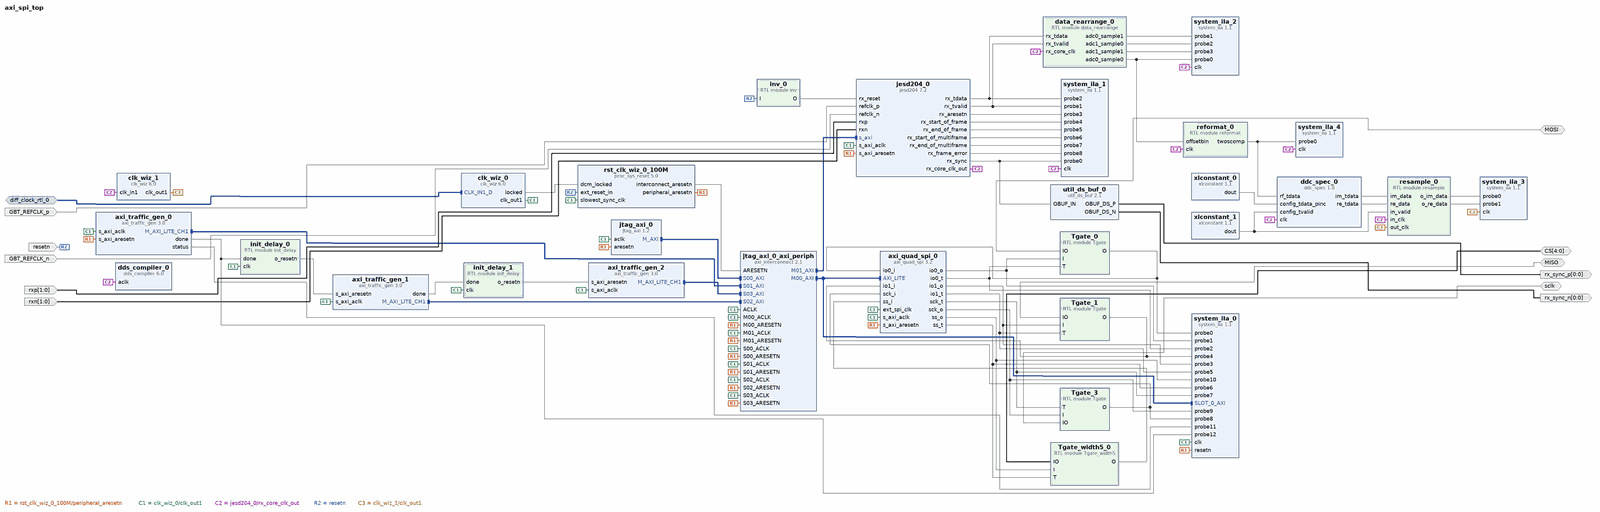
[diagram p0: block diagram of the top level, whole]
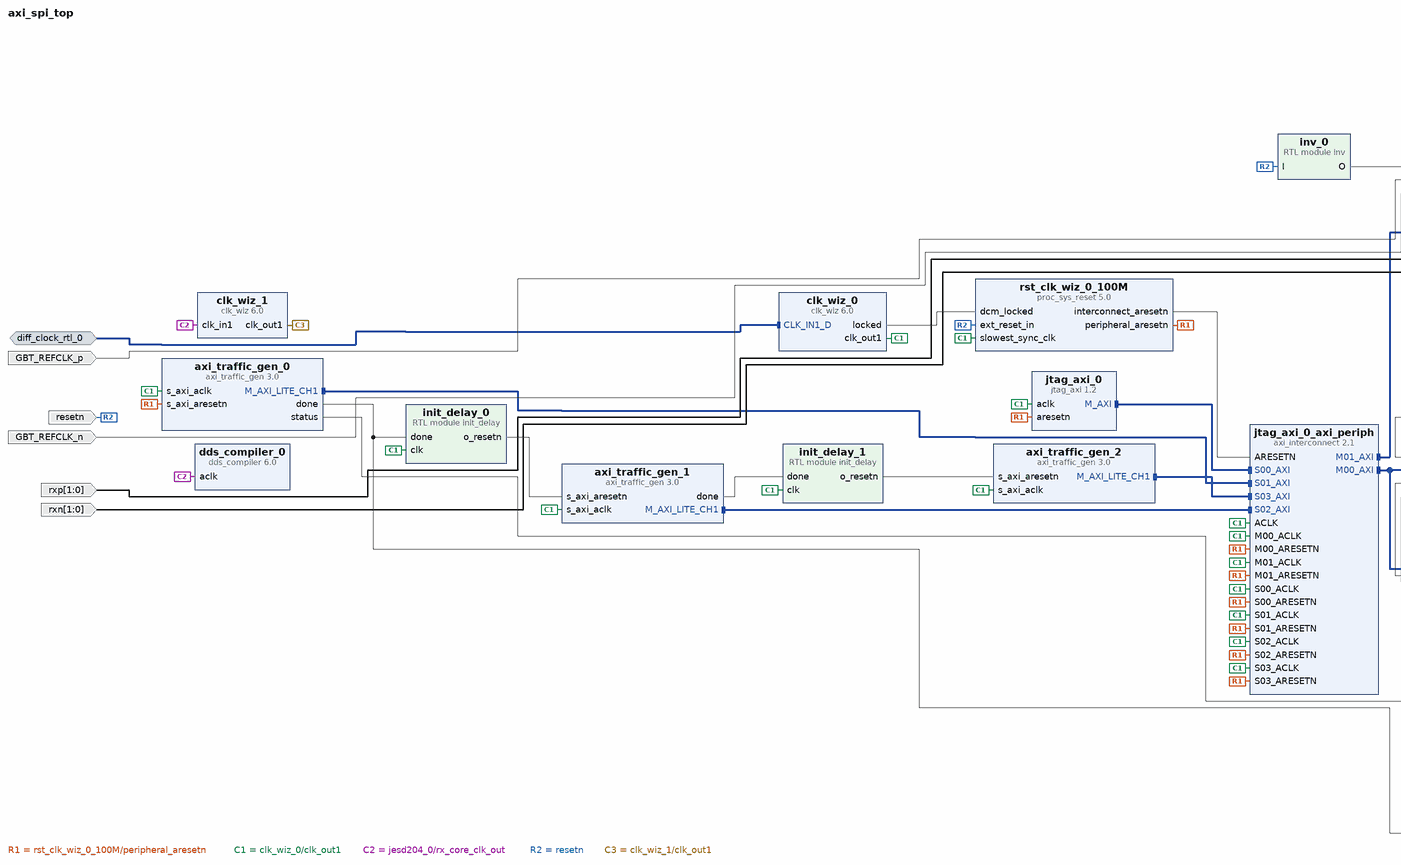
[diagram p1: block diagram of the top level, left part]
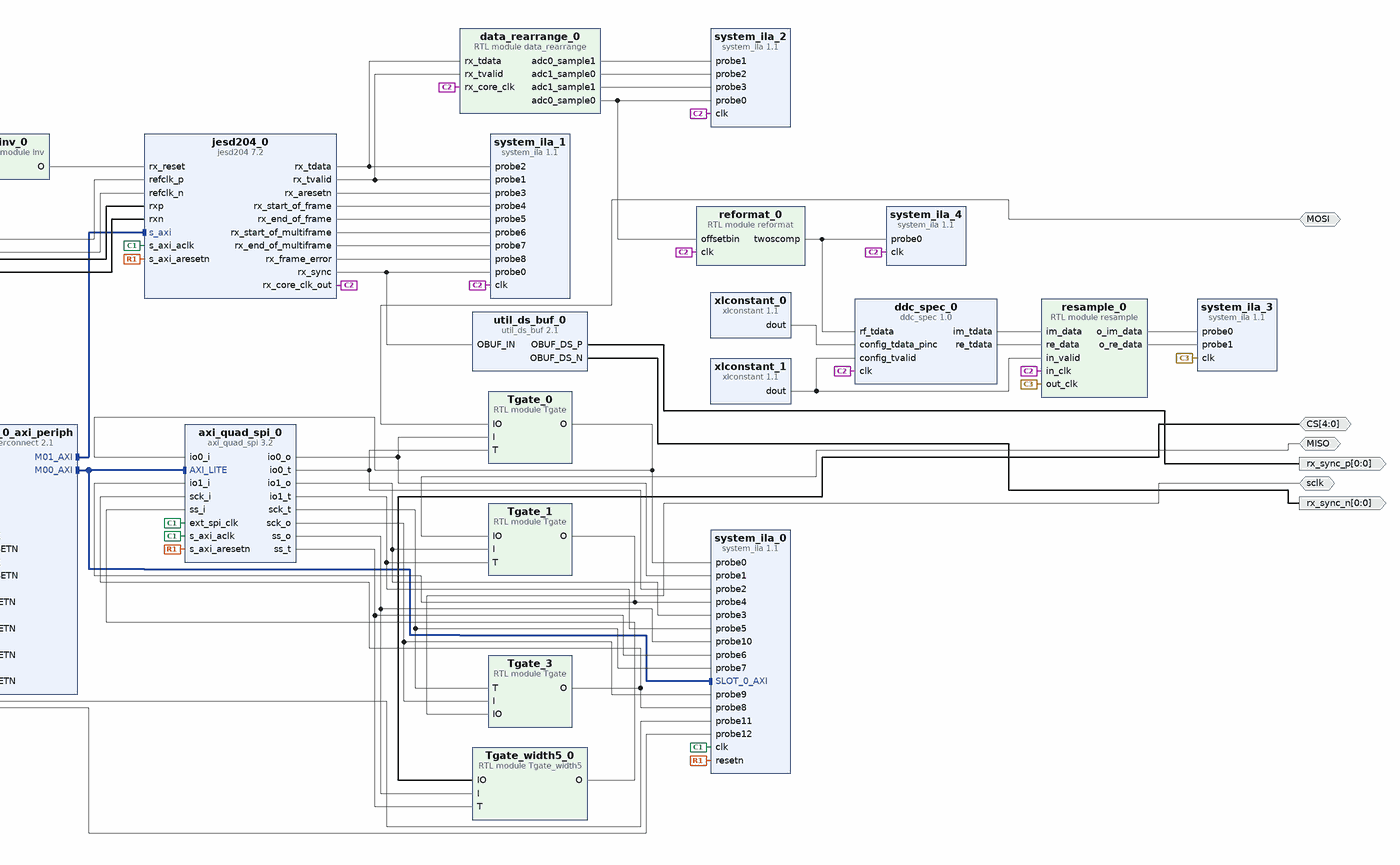
[diagram p2: block diagram of the top level, right part]
# Vivado block design axi_spi_top, xc7k325tffg900-2, Vivado 2018.1
create_bd_design axi_spi_top

create_bd_intf_port -mode Slave -vlnv xilinx.com:interface:diff_clock_rtl:1.0 diff_clock_rtl_0
set_property -dict {CONFIG.FREQ_HZ 200000000} [get_bd_intf_ports diff_clock_rtl_0]
create_bd_port -dir IO -type data MOSI
create_bd_port -dir IO -type data MISO
create_bd_port -dir IO -type clk sclk
set_property -dict {CONFIG.FREQ_HZ 1000000} [get_bd_ports sclk]
create_bd_port -dir IO -from 4 -to 0 CS
create_bd_port -dir I -type clk GBT_REFCLK_p
set_property -dict {CONFIG.FREQ_HZ 125000000} [get_bd_ports GBT_REFCLK_p]
create_bd_port -dir I -type clk GBT_REFCLK_n
set_property -dict {CONFIG.FREQ_HZ 125000000} [get_bd_ports GBT_REFCLK_n]
create_bd_port -dir I -from 1 -to 0 rxp
create_bd_port -dir I -from 1 -to 0 rxn
create_bd_port -dir O -from 0 -to 0 rx_sync_p
create_bd_port -dir O -from 0 -to 0 rx_sync_n
create_bd_port -dir I -type rst resetn
set_property -dict {CONFIG.POLARITY ACTIVE_LOW} [get_bd_ports resetn]

create_bd_cell -type ip -vlnv xilinx.com:ip:axi_quad_spi:3.2 axi_quad_spi_0
set_property -dict [list \
  CONFIG.C_USE_STARTUP 0 \
  CONFIG.C_NUM_TRANSFER_BITS 16 \
  CONFIG.C_NUM_SS_BITS 5 \
  CONFIG.C_SCK_RATIO 16 \
  CONFIG.C_FIFO_DEPTH 256 \
  CONFIG.Multiples16 5 \
  CONFIG.C_S_AXI4_ID_WIDTH 0 \
] [get_bd_cells axi_quad_spi_0]
create_bd_cell -type ip -vlnv xilinx.com:ip:clk_wiz:6.0 clk_wiz_0
set_property -dict [list \
  CONFIG.PRIM_IN_FREQ 200 \
  CONFIG.CLKIN1_JITTER_PS 50.0 \
  CONFIG.CLKOUT2_USED true \
  CONFIG.CLKOUT3_USED false \
  CONFIG.NUM_OUT_CLKS 2 \
  CONFIG.CLKOUT1_REQUESTED_OUT_FREQ 100 \
  CONFIG.CLKOUT2_REQUESTED_OUT_FREQ 250 \
  CONFIG.CLKOUT3_REQUESTED_OUT_FREQ 5 \
  CONFIG.PRIM_SOURCE Differential_clock_capable_pin \
  CONFIG.MMCM_DIVCLK_DIVIDE 1 \
  CONFIG.MMCM_CLKFBOUT_MULT_F 5.000 \
  CONFIG.MMCM_CLKIN1_PERIOD 5.000 \
  CONFIG.MMCM_CLKIN2_PERIOD 10.0 \
  CONFIG.MMCM_CLKOUT0_DIVIDE_F 10.000 \
  CONFIG.MMCM_CLKOUT1_DIVIDE 4 \
  CONFIG.MMCM_CLKOUT2_DIVIDE 1 \
  CONFIG.CLKOUT1_JITTER 112.316 \
  CONFIG.CLKOUT1_PHASE_ERROR 89.971 \
  CONFIG.CLKOUT2_JITTER 93.990 \
  CONFIG.CLKOUT2_PHASE_ERROR 89.971 \
  CONFIG.CLKOUT3_JITTER 185.602 \
  CONFIG.CLKOUT3_PHASE_ERROR 92.989 \
] [get_bd_cells clk_wiz_0]
create_bd_cell -type ip -vlnv xilinx.com:ip:jtag_axi:1.2 jtag_axi_0
create_bd_cell -type ip -vlnv xilinx.com:ip:axi_interconnect:2.1 jtag_axi_0_axi_periph
set_property -dict {CONFIG.NUM_SI 4 CONFIG.NUM_MI 2} [get_bd_cells jtag_axi_0_axi_periph]
create_bd_cell -type ip -vlnv xilinx.com:ip:proc_sys_reset:5.0 rst_clk_wiz_0_100M
create_bd_cell -type ip -vlnv xilinx.com:ip:system_ila:1.1 system_ila_0
set_property -dict [list \
  CONFIG.C_SLOT_0_APC_EN 0 \
  CONFIG.C_SLOT_0_AXI_AW_SEL_DATA 1 \
  CONFIG.C_SLOT_0_AXI_W_SEL_DATA 1 \
  CONFIG.C_SLOT_0_AXI_B_SEL_DATA 1 \
  CONFIG.C_SLOT_0_AXI_AR_SEL_DATA 1 \
  CONFIG.C_SLOT_0_AXI_R_SEL_DATA 1 \
  CONFIG.C_SLOT_0_AXI_AW_SEL_TRIG 1 \
  CONFIG.C_SLOT_0_AXI_W_SEL_TRIG 1 \
  CONFIG.C_SLOT_0_AXI_B_SEL_TRIG 1 \
  CONFIG.C_SLOT_0_AXI_AR_SEL_TRIG 1 \
  CONFIG.C_SLOT_0_AXI_R_SEL_TRIG 1 \
  CONFIG.C_PROBE12_TYPE 0 \
  CONFIG.C_PROBE11_TYPE 0 \
  CONFIG.C_PROBE10_TYPE 0 \
  CONFIG.C_PROBE9_TYPE 0 \
  CONFIG.C_PROBE8_TYPE 0 \
  CONFIG.C_PROBE7_TYPE 0 \
  CONFIG.C_PROBE6_TYPE 0 \
  CONFIG.C_PROBE5_TYPE 0 \
  CONFIG.C_PROBE4_TYPE 0 \
  CONFIG.C_PROBE3_TYPE 0 \
  CONFIG.C_PROBE2_TYPE 0 \
  CONFIG.C_PROBE1_TYPE 0 \
  CONFIG.C_PROBE0_TYPE 0 \
  CONFIG.C_NUM_OF_PROBES 13 \
  CONFIG.C_NUM_MONITOR_SLOTS 1 \
  CONFIG.C_SLOT_0_INTF_TYPE xilinx.com:interface:aximm_rtl:1.0 \
  CONFIG.C_MON_TYPE MIX \
] [get_bd_cells system_ila_0]
create_bd_cell -type module -reference Tgate Tgate_0
create_bd_cell -type module -reference Tgate Tgate_1
create_bd_cell -type module -reference Tgate Tgate_3
create_bd_cell -type module -reference Tgate_width5 Tgate_width5_0
create_bd_cell -type ip -vlnv xilinx.com:ip:jesd204:7.2 jesd204_0
set_property -dict [list \
  CONFIG.C_NODE_IS_TRANSMIT 0 \
  CONFIG.SupportLevel 1 \
  CONFIG.GT_Line_Rate 5 \
  CONFIG.GT_REFCLK_FREQ 125.000 \
  CONFIG.Global_clk_sel false \
  CONFIG.AXICLK_FREQ 100 \
] [get_bd_cells jesd204_0]
create_bd_cell -type ip -vlnv xilinx.com:ip:system_ila:1.1 system_ila_1
set_property -dict [list \
  CONFIG.C_PROBE9_TYPE 0 \
  CONFIG.C_PROBE8_TYPE 0 \
  CONFIG.C_PROBE7_TYPE 0 \
  CONFIG.C_PROBE6_TYPE 0 \
  CONFIG.C_PROBE5_TYPE 0 \
  CONFIG.C_PROBE4_TYPE 0 \
  CONFIG.C_PROBE3_TYPE 0 \
  CONFIG.C_PROBE2_TYPE 0 \
  CONFIG.C_PROBE1_TYPE 0 \
  CONFIG.C_PROBE0_TYPE 0 \
  CONFIG.C_NUM_OF_PROBES 9 \
  CONFIG.C_MON_TYPE NATIVE \
] [get_bd_cells system_ila_1]
create_bd_cell -type ip -vlnv xilinx.com:ip:util_ds_buf:2.1 util_ds_buf_0
set_property -dict {CONFIG.C_BUF_TYPE OBUFDS} [get_bd_cells util_ds_buf_0]
create_bd_cell -type module -reference inv inv_0
create_bd_cell -type module -reference data_rearrange data_rearrange_0
create_bd_cell -type ip -vlnv xilinx.com:ip:system_ila:1.1 system_ila_2
set_property -dict [list \
  CONFIG.C_PROBE7_TYPE 0 \
  CONFIG.C_PROBE6_TYPE 0 \
  CONFIG.C_PROBE5_TYPE 0 \
  CONFIG.C_PROBE4_TYPE 0 \
  CONFIG.C_PROBE3_TYPE 0 \
  CONFIG.C_PROBE2_TYPE 0 \
  CONFIG.C_PROBE1_TYPE 0 \
  CONFIG.C_PROBE0_TYPE 0 \
  CONFIG.C_DATA_DEPTH 4096 \
  CONFIG.C_NUM_OF_PROBES 4 \
  CONFIG.C_MON_TYPE NATIVE \
] [get_bd_cells system_ila_2]
create_bd_cell -type ip -vlnv xilinx.com:ip:axi_traffic_gen:3.0 axi_traffic_gen_0
set_property -dict [list \
  CONFIG.C_ATG_SYSTEM_INIT_DATA_MIF ../axi_spi_top_axi_traffic_gen_0_data.coe \
  CONFIG.C_ATG_SYSTEM_INIT_ADDR_MIF ../axi_spi_top_axi_traffic_gen_0_address.coe \
  CONFIG.C_ATG_MODE AXI4-Lite \
  CONFIG.C_ATG_MIF_DATA_DEPTH 32 \
] [get_bd_cells axi_traffic_gen_0]
create_bd_cell -type module -reference init_delay init_delay_0
create_bd_cell -type ip -vlnv xilinx.com:ip:axi_traffic_gen:3.0 axi_traffic_gen_1
set_property -dict [list \
  CONFIG.C_ATG_SYSTEM_INIT_DATA_MIF ../axi_spi_top_axi_traffic_gen_1_data.coe \
  CONFIG.C_ATG_SYSTEM_INIT_ADDR_MIF ../axi_spi_top_axi_traffic_gen_1_address.coe \
  CONFIG.C_ATG_MODE AXI4-Lite \
  CONFIG.C_ATG_MIF_DATA_DEPTH 32 \
] [get_bd_cells axi_traffic_gen_1]
create_bd_cell -type ip -vlnv xilinx.com:ip:axi_traffic_gen:3.0 axi_traffic_gen_2
set_property -dict [list \
  CONFIG.C_ATG_SYSTEM_INIT_DATA_MIF ../axi_spi_top_axi_traffic_gen_2_data.coe \
  CONFIG.C_ATG_SYSTEM_INIT_ADDR_MIF ../axi_spi_top_axi_traffic_gen_2_address.coe \
  CONFIG.C_ATG_MODE AXI4-Lite \
  CONFIG.C_ATG_MIF_DATA_DEPTH 32 \
] [get_bd_cells axi_traffic_gen_2]
create_bd_cell -type module -reference init_delay init_delay_1
create_bd_cell -type ip -vlnv User_Company:SysGen:ddc_spec:1.0 ddc_spec_0
create_bd_cell -type ip -vlnv xilinx.com:ip:xlconstant:1.1 xlconstant_0
set_property -dict {CONFIG.CONST_WIDTH 27 CONFIG.CONST_VAL 32212254} [get_bd_cells xlconstant_0]
create_bd_cell -type ip -vlnv xilinx.com:ip:xlconstant:1.1 xlconstant_1
create_bd_cell -type ip -vlnv xilinx.com:ip:dds_compiler:6.0 dds_compiler_0
set_property -dict [list \
  CONFIG.DDS_Clock_Rate 125 \
  CONFIG.Parameter_Entry Hardware_Parameters \
  CONFIG.Frequency_Resolution 0.4 \
  CONFIG.Noise_Shaping None \
  CONFIG.Phase_Width 32 \
  CONFIG.Output_Width 14 \
  CONFIG.Output_Selection Sine \
  CONFIG.Has_Phase_Out false \
  CONFIG.M_DATA_Has_TUSER Not_Required \
  CONFIG.Latency 7 \
  CONFIG.Output_Frequency1 0 \
  CONFIG.PINC1 111111011111001110110110010001 \
] [get_bd_cells dds_compiler_0]
create_bd_cell -type ip -vlnv xilinx.com:ip:clk_wiz:6.0 clk_wiz_1
set_property -dict [list \
  CONFIG.PRIM_IN_FREQ 125 \
  CONFIG.CLKIN1_JITTER_PS 80.0 \
  CONFIG.CLKOUT1_REQUESTED_OUT_FREQ 12.5 \
  CONFIG.PRIM_SOURCE Global_buffer \
  CONFIG.MMCM_DIVCLK_DIVIDE 5 \
  CONFIG.MMCM_CLKFBOUT_MULT_F 30.250 \
  CONFIG.MMCM_CLKIN1_PERIOD 8.000 \
  CONFIG.MMCM_CLKOUT0_DIVIDE_F 60.500 \
  CONFIG.CLKOUT1_JITTER 414.133 \
  CONFIG.CLKOUT1_PHASE_ERROR 282.214 \
] [get_bd_cells clk_wiz_1]
create_bd_cell -type module -reference resample resample_0
create_bd_cell -type ip -vlnv xilinx.com:ip:system_ila:1.1 system_ila_3
set_property -dict [list \
  CONFIG.C_PROBE1_TYPE 0 \
  CONFIG.C_PROBE0_TYPE 0 \
  CONFIG.C_DATA_DEPTH 65536 \
  CONFIG.C_NUM_OF_PROBES 2 \
  CONFIG.C_MON_TYPE NATIVE \
] [get_bd_cells system_ila_3]
create_bd_cell -type module -reference reformat reformat_0
create_bd_cell -type ip -vlnv xilinx.com:ip:system_ila:1.1 system_ila_4
set_property -dict {CONFIG.C_PROBE0_TYPE 0 CONFIG.C_NUM_OF_PROBES 1 CONFIG.C_MON_TYPE NATIVE} [get_bd_cells system_ila_4]

# ---- connections ----

connect_bd_intf_net [get_bd_intf_pins jtag_axi_0/M_AXI] [get_bd_intf_pins jtag_axi_0_axi_periph/S00_AXI]
connect_bd_intf_net [get_bd_intf_pins jtag_axi_0_axi_periph/M00_AXI] [get_bd_intf_pins axi_quad_spi_0/AXI_LITE]
connect_bd_intf_net [get_bd_intf_pins jtag_axi_0_axi_periph/M00_AXI] [get_bd_intf_pins system_ila_0/SLOT_0_AXI]
connect_bd_intf_net [get_bd_intf_pins jesd204_0/s_axi] [get_bd_intf_pins jtag_axi_0_axi_periph/M01_AXI]
connect_bd_intf_net [get_bd_intf_pins axi_traffic_gen_0/M_AXI_LITE_CH1] [get_bd_intf_pins jtag_axi_0_axi_periph/S01_AXI]
connect_bd_intf_net [get_bd_intf_pins axi_traffic_gen_1/M_AXI_LITE_CH1] [get_bd_intf_pins jtag_axi_0_axi_periph/S02_AXI]
connect_bd_intf_net [get_bd_intf_pins axi_traffic_gen_2/M_AXI_LITE_CH1] [get_bd_intf_pins jtag_axi_0_axi_periph/S03_AXI]
connect_bd_intf_net -intf_net diff_clock_rtl_0_1 [get_bd_intf_ports diff_clock_rtl_0] [get_bd_intf_pins clk_wiz_0/CLK_IN1_D]
connect_bd_net [get_bd_pins clk_wiz_0/locked] [get_bd_pins rst_clk_wiz_0_100M/dcm_locked]
connect_bd_net [get_bd_pins rst_clk_wiz_0_100M/peripheral_aresetn] \
  [get_bd_pins axi_quad_spi_0/s_axi_aresetn] [get_bd_pins jtag_axi_0/aresetn] [get_bd_pins system_ila_0/resetn] \
  [get_bd_pins jesd204_0/s_axi_aresetn] [get_bd_pins axi_traffic_gen_0/s_axi_aresetn] \
  [get_bd_pins jtag_axi_0_axi_periph/S00_ARESETN] [get_bd_pins jtag_axi_0_axi_periph/M00_ARESETN] \
  [get_bd_pins jtag_axi_0_axi_periph/M01_ARESETN] [get_bd_pins jtag_axi_0_axi_periph/S01_ARESETN] \
  [get_bd_pins jtag_axi_0_axi_periph/S02_ARESETN] [get_bd_pins jtag_axi_0_axi_periph/S03_ARESETN]
connect_bd_net [get_bd_pins rst_clk_wiz_0_100M/interconnect_aresetn] [get_bd_pins jtag_axi_0_axi_periph/ARESETN]
connect_bd_net [get_bd_pins Tgate_0/O] [get_bd_pins axi_quad_spi_0/io0_i] [get_bd_pins system_ila_0/probe0]
connect_bd_net [get_bd_pins axi_quad_spi_0/io0_o] [get_bd_pins system_ila_0/probe1] [get_bd_pins Tgate_0/I]
connect_bd_net [get_bd_pins axi_quad_spi_0/io0_t] [get_bd_pins system_ila_0/probe2] [get_bd_pins Tgate_0/T]
connect_bd_net [get_bd_pins axi_quad_spi_0/io1_o] [get_bd_pins system_ila_0/probe3] [get_bd_pins Tgate_1/I]
connect_bd_net [get_bd_pins Tgate_1/O] [get_bd_pins axi_quad_spi_0/io1_i] [get_bd_pins system_ila_0/probe4]
connect_bd_net [get_bd_pins axi_quad_spi_0/io1_t] [get_bd_pins system_ila_0/probe5] [get_bd_pins Tgate_1/T]
connect_bd_net [get_bd_pins axi_quad_spi_0/ss_o] [get_bd_pins Tgate_width5_0/I] [get_bd_pins system_ila_0/probe10]
connect_bd_net [get_bd_pins axi_quad_spi_0/ss_t] [get_bd_pins system_ila_0/probe6] [get_bd_pins Tgate_width5_0/T]
connect_bd_net [get_bd_ports MOSI] [get_bd_pins Tgate_0/IO]
connect_bd_net [get_bd_ports MISO] [get_bd_pins Tgate_1/IO]
connect_bd_net [get_bd_pins axi_quad_spi_0/sck_t] [get_bd_pins Tgate_3/T] [get_bd_pins system_ila_0/probe7]
connect_bd_net [get_bd_pins Tgate_3/O] [get_bd_pins axi_quad_spi_0/sck_i] [get_bd_pins system_ila_0/probe8]
connect_bd_net [get_bd_pins axi_quad_spi_0/sck_o] [get_bd_pins Tgate_3/I] [get_bd_pins system_ila_0/probe9]
connect_bd_net [get_bd_ports sclk] [get_bd_pins Tgate_3/IO]
connect_bd_net [get_bd_ports CS] [get_bd_pins Tgate_width5_0/IO]
connect_bd_net [get_bd_pins Tgate_width5_0/O] [get_bd_pins axi_quad_spi_0/ss_i]
connect_bd_net [get_bd_pins clk_wiz_0/clk_out1] \
  [get_bd_pins axi_quad_spi_0/ext_spi_clk] [get_bd_pins axi_quad_spi_0/s_axi_aclk] [get_bd_pins jtag_axi_0/aclk] \
  [get_bd_pins rst_clk_wiz_0_100M/slowest_sync_clk] [get_bd_pins system_ila_0/clk] [get_bd_pins jesd204_0/s_axi_aclk] \
  [get_bd_pins axi_traffic_gen_0/s_axi_aclk] [get_bd_pins axi_traffic_gen_1/s_axi_aclk] \
  [get_bd_pins axi_traffic_gen_2/s_axi_aclk] [get_bd_pins init_delay_0/clk] [get_bd_pins init_delay_1/clk] \
  [get_bd_pins jtag_axi_0_axi_periph/ACLK] [get_bd_pins jtag_axi_0_axi_periph/S00_ACLK] \
  [get_bd_pins jtag_axi_0_axi_periph/M00_ACLK] [get_bd_pins jtag_axi_0_axi_periph/M01_ACLK] \
  [get_bd_pins jtag_axi_0_axi_periph/S01_ACLK] [get_bd_pins jtag_axi_0_axi_periph/S02_ACLK] \
  [get_bd_pins jtag_axi_0_axi_periph/S03_ACLK]
connect_bd_net [get_bd_ports GBT_REFCLK_p] [get_bd_pins jesd204_0/refclk_p]
connect_bd_net [get_bd_ports GBT_REFCLK_n] [get_bd_pins jesd204_0/refclk_n]
connect_bd_net [get_bd_ports rxp] [get_bd_pins jesd204_0/rxp]
connect_bd_net [get_bd_ports rxn] [get_bd_pins jesd204_0/rxn]
connect_bd_net [get_bd_pins jesd204_0/rx_tdata] [get_bd_pins system_ila_1/probe2] [get_bd_pins data_rearrange_0/rx_tdata]
connect_bd_net [get_bd_pins jesd204_0/rx_aresetn] [get_bd_pins system_ila_1/probe3]
connect_bd_net [get_bd_pins jesd204_0/rx_start_of_frame] [get_bd_pins system_ila_1/probe4]
connect_bd_net [get_bd_pins jesd204_0/rx_end_of_frame] [get_bd_pins system_ila_1/probe5]
connect_bd_net [get_bd_pins jesd204_0/rx_start_of_multiframe] [get_bd_pins system_ila_1/probe6]
connect_bd_net [get_bd_pins jesd204_0/rx_end_of_multiframe] [get_bd_pins system_ila_1/probe7]
connect_bd_net [get_bd_pins jesd204_0/rx_frame_error] [get_bd_pins system_ila_1/probe8]
connect_bd_net [get_bd_pins jesd204_0/rx_sync] [get_bd_pins system_ila_1/probe0] [get_bd_pins util_ds_buf_0/OBUF_IN]
connect_bd_net [get_bd_pins util_ds_buf_0/OBUF_DS_P] [get_bd_ports rx_sync_p]
connect_bd_net [get_bd_pins util_ds_buf_0/OBUF_DS_N] [get_bd_ports rx_sync_n]
connect_bd_net [get_bd_pins jesd204_0/rx_core_clk_out] \
  [get_bd_pins data_rearrange_0/rx_core_clk] [get_bd_pins system_ila_2/clk] [get_bd_pins ddc_spec_0/clk] \
  [get_bd_pins dds_compiler_0/aclk] [get_bd_pins clk_wiz_1/clk_in1] [get_bd_pins resample_0/in_clk] \
  [get_bd_pins system_ila_1/clk] [get_bd_pins reformat_0/clk] [get_bd_pins system_ila_4/clk]
connect_bd_net [get_bd_ports resetn] [get_bd_pins rst_clk_wiz_0_100M/ext_reset_in] [get_bd_pins inv_0/I]
connect_bd_net [get_bd_pins inv_0/O] [get_bd_pins jesd204_0/rx_reset]
connect_bd_net [get_bd_pins data_rearrange_0/adc0_sample1] [get_bd_pins system_ila_2/probe1]
connect_bd_net [get_bd_pins data_rearrange_0/adc1_sample0] [get_bd_pins system_ila_2/probe2]
connect_bd_net [get_bd_pins data_rearrange_0/adc1_sample1] [get_bd_pins system_ila_2/probe3]
connect_bd_net [get_bd_pins jesd204_0/rx_tvalid] [get_bd_pins system_ila_1/probe1] [get_bd_pins data_rearrange_0/rx_tvalid]
connect_bd_net [get_bd_pins axi_traffic_gen_0/status] [get_bd_pins system_ila_0/probe11]
connect_bd_net [get_bd_pins axi_traffic_gen_0/done] [get_bd_pins system_ila_0/probe12] [get_bd_pins init_delay_0/done]
connect_bd_net [get_bd_pins init_delay_0/o_resetn] [get_bd_pins axi_traffic_gen_1/s_axi_aresetn]
connect_bd_net [get_bd_pins axi_traffic_gen_1/done] [get_bd_pins init_delay_1/done]
connect_bd_net [get_bd_pins init_delay_1/o_resetn] [get_bd_pins axi_traffic_gen_2/s_axi_aresetn]
connect_bd_net [get_bd_pins xlconstant_0/dout] [get_bd_pins ddc_spec_0/config_tdata_pinc]
connect_bd_net [get_bd_pins xlconstant_1/dout] [get_bd_pins ddc_spec_0/config_tvalid] [get_bd_pins resample_0/in_valid]
connect_bd_net [get_bd_pins ddc_spec_0/im_tdata] [get_bd_pins resample_0/im_data]
connect_bd_net [get_bd_pins ddc_spec_0/re_tdata] [get_bd_pins resample_0/re_data]
connect_bd_net [get_bd_pins clk_wiz_1/clk_out1] [get_bd_pins resample_0/out_clk] [get_bd_pins system_ila_3/clk]
connect_bd_net [get_bd_pins resample_0/o_im_data] [get_bd_pins system_ila_3/probe0]
connect_bd_net [get_bd_pins resample_0/o_re_data] [get_bd_pins system_ila_3/probe1]
connect_bd_net [get_bd_pins data_rearrange_0/adc0_sample0] [get_bd_pins system_ila_2/probe0] [get_bd_pins reformat_0/offsetbin]
connect_bd_net [get_bd_pins reformat_0/twoscomp] [get_bd_pins ddc_spec_0/rf_tdata] [get_bd_pins system_ila_4/probe0]

# ---- address map ----
assign_bd_address -offset 0x44A00000 -range 64K -target_address_space [get_bd_addr_spaces axi_traffic_gen_0/Reg1] [get_bd_addr_segs axi_quad_spi_0/AXI_LITE/Reg]
assign_bd_address -offset 0x44A10000 -range 64K -target_address_space [get_bd_addr_spaces axi_traffic_gen_0/Reg1] [get_bd_addr_segs jesd204_0/s_axi/Reg]
assign_bd_address -offset 0x44A00000 -range 64K -target_address_space [get_bd_addr_spaces axi_traffic_gen_1/Reg1] [get_bd_addr_segs axi_quad_spi_0/AXI_LITE/Reg]
assign_bd_address -offset 0x44A10000 -range 64K -target_address_space [get_bd_addr_spaces axi_traffic_gen_1/Reg1] [get_bd_addr_segs jesd204_0/s_axi/Reg]
assign_bd_address -offset 0x44A00000 -range 64K -target_address_space [get_bd_addr_spaces axi_traffic_gen_2/Reg1] [get_bd_addr_segs axi_quad_spi_0/AXI_LITE/Reg]
assign_bd_address -offset 0x44A10000 -range 64K -target_address_space [get_bd_addr_spaces axi_traffic_gen_2/Reg1] [get_bd_addr_segs jesd204_0/s_axi/Reg]
assign_bd_address -offset 0x44A00000 -range 64K -target_address_space [get_bd_addr_spaces jtag_axi_0/Data] [get_bd_addr_segs axi_quad_spi_0/AXI_LITE/Reg]
assign_bd_address -offset 0x44A10000 -range 64K -target_address_space [get_bd_addr_spaces jtag_axi_0/Data] [get_bd_addr_segs jesd204_0/s_axi/Reg]

validate_bd_design
save_bd_design
